# Altium schematic sheet Clock Input.SchDoc
size 297 x 209 mm; CompanyName: Sainsbury Wellcome Centre; Organization: FabLab; Address1: Sainsbury Wellcome Centre; Address2: 25 Howland Street; Address3: London; Address4: W1T 4JG; DocumentNumber: 12; SheetNumber: 12; SheetTotal: 14; swcgroup: FabLab; Org: Sainsbury Wellcome Centre; Add1: 25 Howland Street; Add2: London; Add3: W1T 4JG; WebAddress: www.sainsburywellcome.org; SheetSize: A4; SheetName: Clock Input
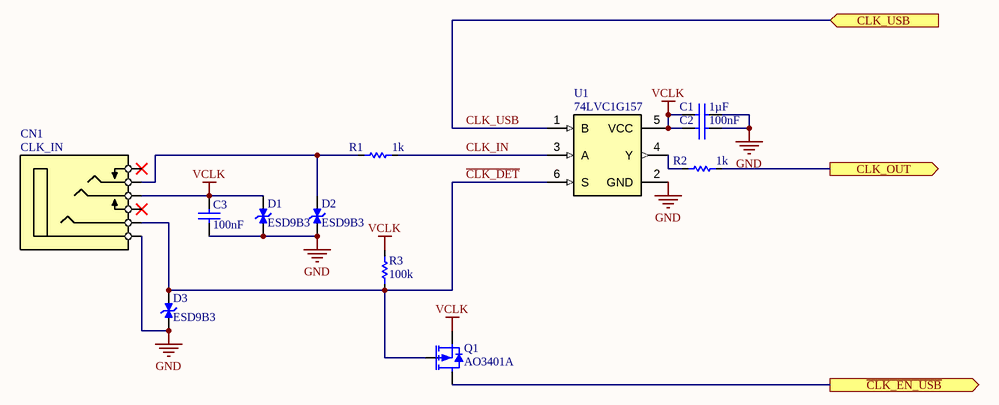
[diagram p0: Clock Input.SchDoc]

## Parts
C1  value 1µF  [CAP_CHIP_0603]  (hidden comment: C0603-1uF-50V)
C2  value 100nF  [CAP_CHIP_0603]  (hidden comment: C0603-100nF-50V)
C3  value 100nF  [CAP_CHIP_0603]  (hidden comment: C0603-100nF-50V)
CN1  CLK_IN  [PJ-316A]
D1  ESD9B3  [SOD923]
D2  ESD9B3  [SOD923]
D3  ESD9B3  [SOD923]
Q1  AO3401A  [SOT23]
R1  value 1k  [RES_CHIP_0603]  (hidden comment: R0603-1K)
R2  value 1k  [RES_CHIP_0603]  (hidden comment: R0603-1K)
R3  value 100k  [RES_CHIP_0603]  (hidden comment: R0603-100K)
U1  74LVC1G157  [SOT363]

## Ports
CLK_OUT (out), CLK_USB (in), ~{CLK_EN_USB} (out)

## Nets
GND: C1.1 C2.1 C3.1 CN1.1(S) D1.1(K) D2.1(K) D3.1(K) U1.2(GND)
VCLK: C1.2 C2.2 C3.2 CN1.3(R) D1.2(A) Q1.2(S) R3.2 U1.5(VCC)
~{CLK_DET}: CN1.4(RR) D3.2(A) Q1.1(G) R3.1 U1.6(S)
~{CLK_EN_USB}: Q1.3(D) ; port ~{CLK_EN_USB}
CLK_IN: R1.1 U1.3(A)
CLK_OUT: R2.1 ; port CLK_OUT
CLK_USB: U1.1(B) ; port CLK_USB
NetCN1_2: CN1.2(T) D2.2(A) R1.2
NetR2_2: R2.2 U1.4(Y)

Not connected (* = marked no-connect by the designer): CN1 5(TS)* 6(RS)*

## Notes on the sheet
- FILE
- VARIANT
- DATE
- REVISION
- SHEET
- /
- PROJECT
- SIZE

## Library data of the parts
C1 = CMP-611-0033-11: 0603 Multilayer Ceramic Capacitors MLCC; PartNumber: CL10A105KB8NNNC; Pick&PlaceFootprint: C0603; Voltage Rating: 50V; Dielectric: X5R; Tolerance: 10%; Case/Package: 0603; LCSC Part N.: C15849; RoHS: Yes; Mount: SMD; Capacitor Type: Ceramic
C2 = CMP-611-0027-24: 0603 Multilayer Ceramic Capacitors MLCC; PartNumber: CC0603KRX7R9BB104; Tolerance: 10%; Pick&PlaceFootprint: C0603; Dielectric: X7R; Voltage Rating: 50V; Capacitor Type: Ceramic; RoHS: Yes; Mount: SMD; LCSC Part N.: C14663; Case/Package: 0603
C3 = CMP-611-0027-24: 0603 Multilayer Ceramic Capacitors MLCC; PartNumber: CC0603KRX7R9BB104; Voltage Rating: 50V; Pick&PlaceFootprint: C0603; Dielectric: X7R; Tolerance: 10%; LCSC Part N.: C14663; Capacitor Type: Ceramic; Case/Package: 0603; RoHS: Yes; Mount: SMD
CN1 = CMP-380-0019-5: 3.5mm headphone jack 235℃ 30V 500mA SMD Audio Connector; PartNumber: PJ-316A-6A; Gender: Female; IEC Conformance: No; Mount: Through Hole; LCSC Part N.: C128987; Orientation: Horizontal; Pitch: 3.5mm
D1-D3 = CMP-210-0004-2: ESD9B3.3ST5G, Bi-Directional TVS Diode, 300mW, 2-Pin SOD-923; Stand-off Voltage: 3.3V; Pick&PlaceFootprint: SOT-23; Breakdown Voltage: 5V; Clamp Voltage: 11.5V; LCSC Part N.: C96512; PartNumber: ESD9B3.3ST5G
Q1 = CMP-810-0003-2: 30V 4A 44mΩ@10V,4.3A 1.4W 1.3V@250uA 1 PChannel SOT-23-3L MOSFETs; RDS(ON): 44mR; Gate-Source Voltage (Vgs): 12V; Pick&PlaceFootprint: SOT-23; Drain Current (Id): -4A; Switching Time: 60ns; Drain-Source Voltage (Vds): -30V; Polarity: P Channel; Power Dissipation: 1.4W; LCSC Part N.: C15127; Mount: Surface Mount; PartNumber: AO3401A
R1 R2 = CMP-633-0013-26: 100mW Thick Film Resistors 75V ±100ppm/℃ ±1% 0603 Chip Resistor; PartNumber: 0603WAF1001T5E; Pick&PlaceFootprint: R0603; Number of Resistors: 1; Voltage Rating: 75V; Mount: Surface Mount; Case/Package: 0603; LCSC Part N.: C21190; Tolerance: 1%; Power Rating: 100mW
R3 = CMP-633-0000-28: 100mW Thick Film Resistors 75V ±100ppm/℃ ±1% 0603 Chip Resistor; PartNumber: 0603WAF1003T5E; Number of Resistors: 1; Pick&PlaceFootprint: R0603; LCSC Part N.: C25803; Mount: Surface Mount; Voltage Rating: 75V; Power Rating: 100mW; Case/Package: 0603; Tolerance: 1%
U1 = CMP-9A0-0002-3: Encoders, Decoders, Multiplexers & Demultiplexers 74LVC1G157GV-Q100/SC-74/REEL 7; Min Supply Voltage: 1.65V; Max Supply Voltage: 5.5V; Max Output current: 32mA; LCSC Part N.: C135822; PartNumber: 74LVC1G157GV